# EasyEDA schematic Attiny_Sumo_2020-05-22_18-39-58.json
TITLE: Sheet_1; REV: 1.0; Date: 2020-05-09; Sheet: 1/1; Company: Your Company
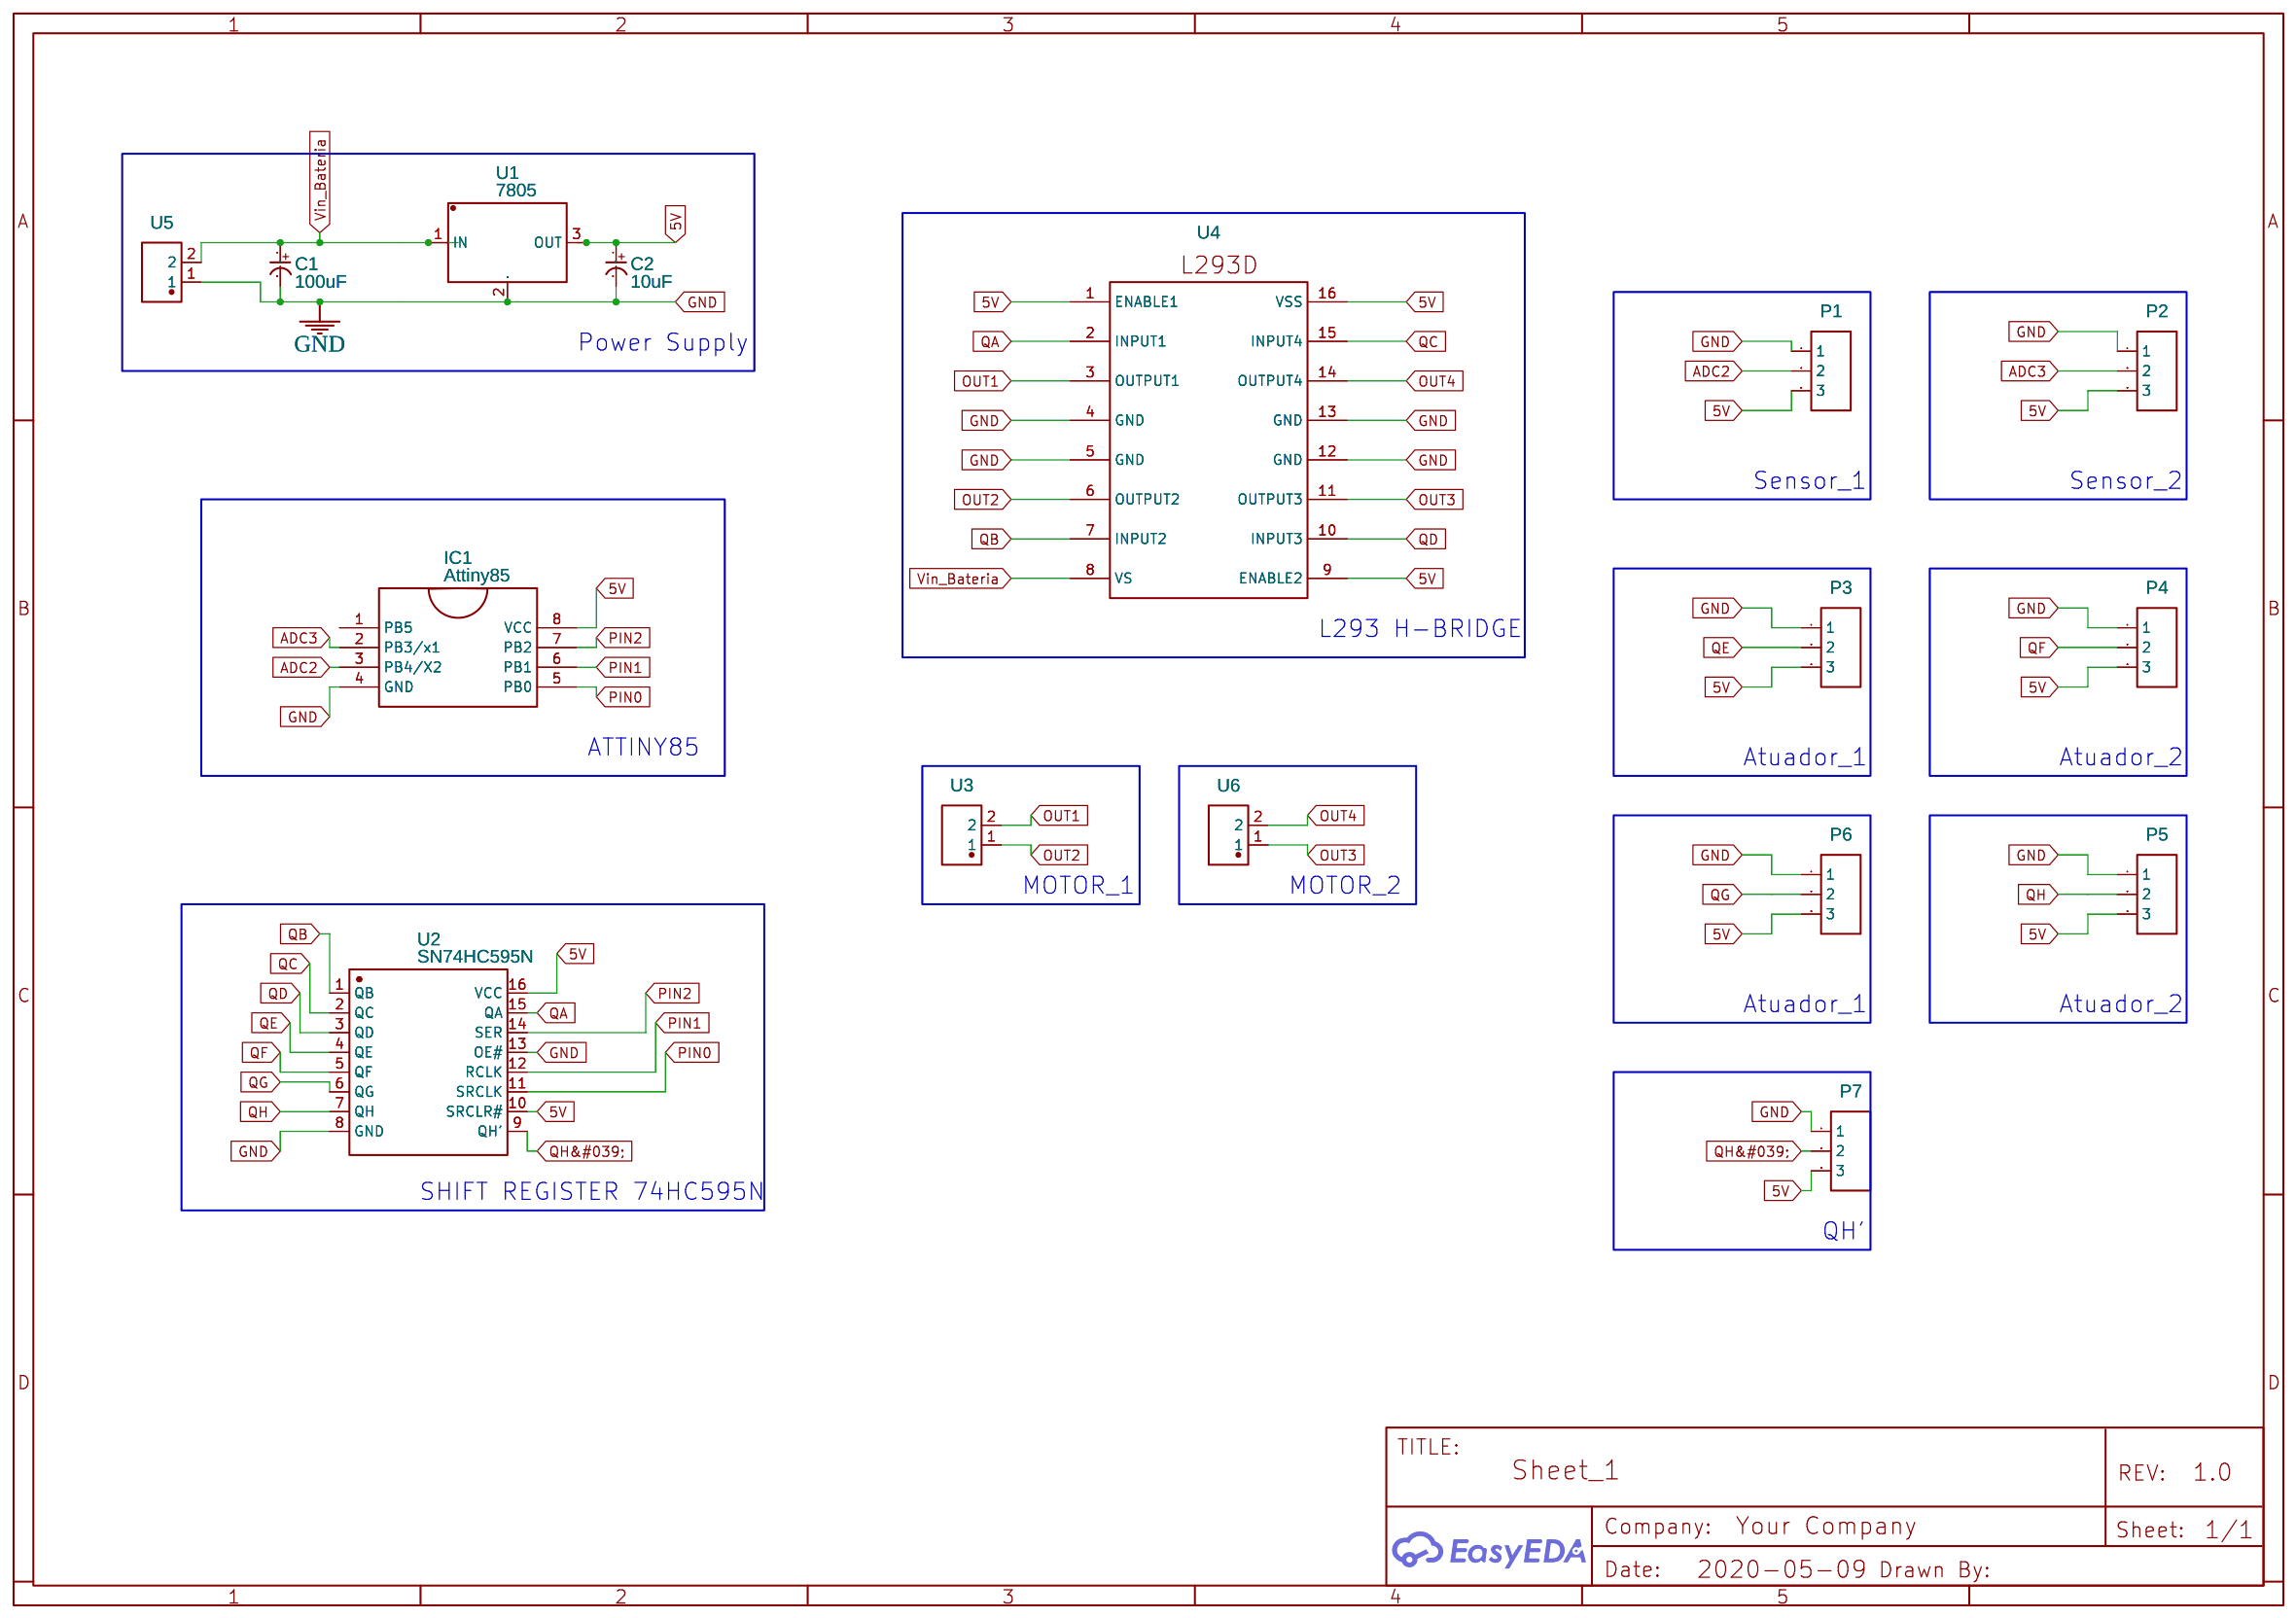
[diagram p0: schematic sheet]

## Parts
C1  100uF  [ELE. CAP]
C2  10uF  [ELE. CAP]
IC1  Attiny85  [DIP8]
P1  Header-Female-2.54_1x3  [HDR-TH_3P-P2.54-V]
P2  Header-Female-2.54_1x3  [HDR-TH_3P-P2.54-V]
P3  Header-Female-2.54_1x3  [HDR-TH_3P-P2.54-V]
P4  Header-Female-2.54_1x3  [HDR-TH_3P-P2.54-V]
P5  Header-Female-2.54_1x3  [HDR-TH_3P-P2.54-V]
P6  Header-Female-2.54_1x3  [HDR-TH_3P-P2.54-V]
P7  Header-Female-2.54_1x3  [HDR-TH_3P-P2.54-V]
U1  7805  [TO-220]
U2  SN74HC595N  [DIP-16_L19.8-W6.5-P2.54-LS7.6-BL]
U3  KF396-3.96-2P  [CONN-TH_P3.96_KF396-3.96-2P]
U4  L293D  [DIP-16]
U5  KF396-3.96-2P  [CONN-TH_P3.96_KF396-3.96-2P]
U6  KF396-3.96-2P  [CONN-TH_P3.96_KF396-3.96-2P]

## Library data of the parts
C1 C2 = capacitor: Contributor: syadav
IC1 = Attiny85: Contributor: Nuros
P1-P7 = Header-Female-2.54_1x3: Supplier Part: C146243; Supplier: LCSC; Manufacturer: Boom Precision Elec; link: https://datasheet.lcsc.com/szlcsc/Boom-Precision-Elec-2-54mm-1-8P-Straight-Female-header_C27438.pdf
U1 = 7805: Supplier: LCSC; Supplier Part: C305416; Manufacturer: Foshan Blue Rocket Elec; Contributor: Brian Schneider
U2 = SN74HC595N: Supplier: LCSC; Manufacturer: TI; image: //image.lceda.cn/szlcsc/C78711.jpg; Supplier Part: C78711
U3 U5 U6 = KF396-3.96-2P: Supplier: LCSC; Supplier Part: C474894; Manufacturer: Cixi Kefa Elec; Contributor: LCSC
U4 = L293D: Contributor: Nathalia Quintero; Supplier: LCSC; Manufacturer: STMicroelectronics; image: //image.lceda.cn/szlcsc/C12340.jpg; Supplier Part: C12340

## Nets
5V: C2.1 IC1.8(VCC) P1.3 P2.3 P3.3 P4.3 P5.3 P6.3 P7.3 U1.3(OUT) U2.10(SRCLR#) U2.16(VCC) U4.1(ENABLE1) U4.9(ENABLE2) U4.16(VSS)
GND: C1.2 C2.2 IC1.4(GND) P1.1 P2.1 P3.1 P4.1 P5.1 P6.1 P7.1 U1.2(GND) U2.8(GND) U2.13(OE#) U4.4(GND) U4.5(GND) U4.12(GND) U4.13(GND) U5.1
Vin_Bateria: C1.1 U1.1(IN) U4.8(VS) U5.2
ADC2: IC1.3(PB4/X2) P1.2
ADC3: IC1.2(PB3/x1) P2.2
OUT1: U3.2 U4.3(OUTPUT1)
OUT2: U3.1 U4.6(OUTPUT2)
OUT3: U4.11(OUTPUT3) U6.1
OUT4: U4.14(OUTPUT4) U6.2
PIN0: IC1.5(PB0) U2.11(SRCLK)
PIN1: IC1.6(PB1) U2.12(RCLK)
PIN2: IC1.7(PB2) U2.14(SER)
QA: U2.15(QA) U4.2(INPUT1)
QB: U2.1(QB) U4.7(INPUT2)
QC: U2.2(QC) U4.15(INPUT4)
QD: U2.3(QD) U4.10(INPUT3)
QE: P3.2 U2.4(QE)
QF: P4.2 U2.5(QF)
QG: P6.2 U2.6(QG)
QH: P5.2 U2.7(QH)
QH&#039;: P7.2 U2.9(QH')

Not connected (* = marked no-connect by the designer): IC1 1(PB5)

## Notes on the sheet
- Power Supply
- Sensor_1
- Sensor_2
- L293 H-BRIDGE
- ATTINY85
- Atuador_1
- Atuador_2
- MOTOR_1
- MOTOR_2
- Atuador_1
- Atuador_2
- SHIFT REGISTER 74HC595N
- QH'
